# Altium schematic sheet [03]GateDriver.SchDoc
size A4; SheetNumber: 3; SheetTotal: 5
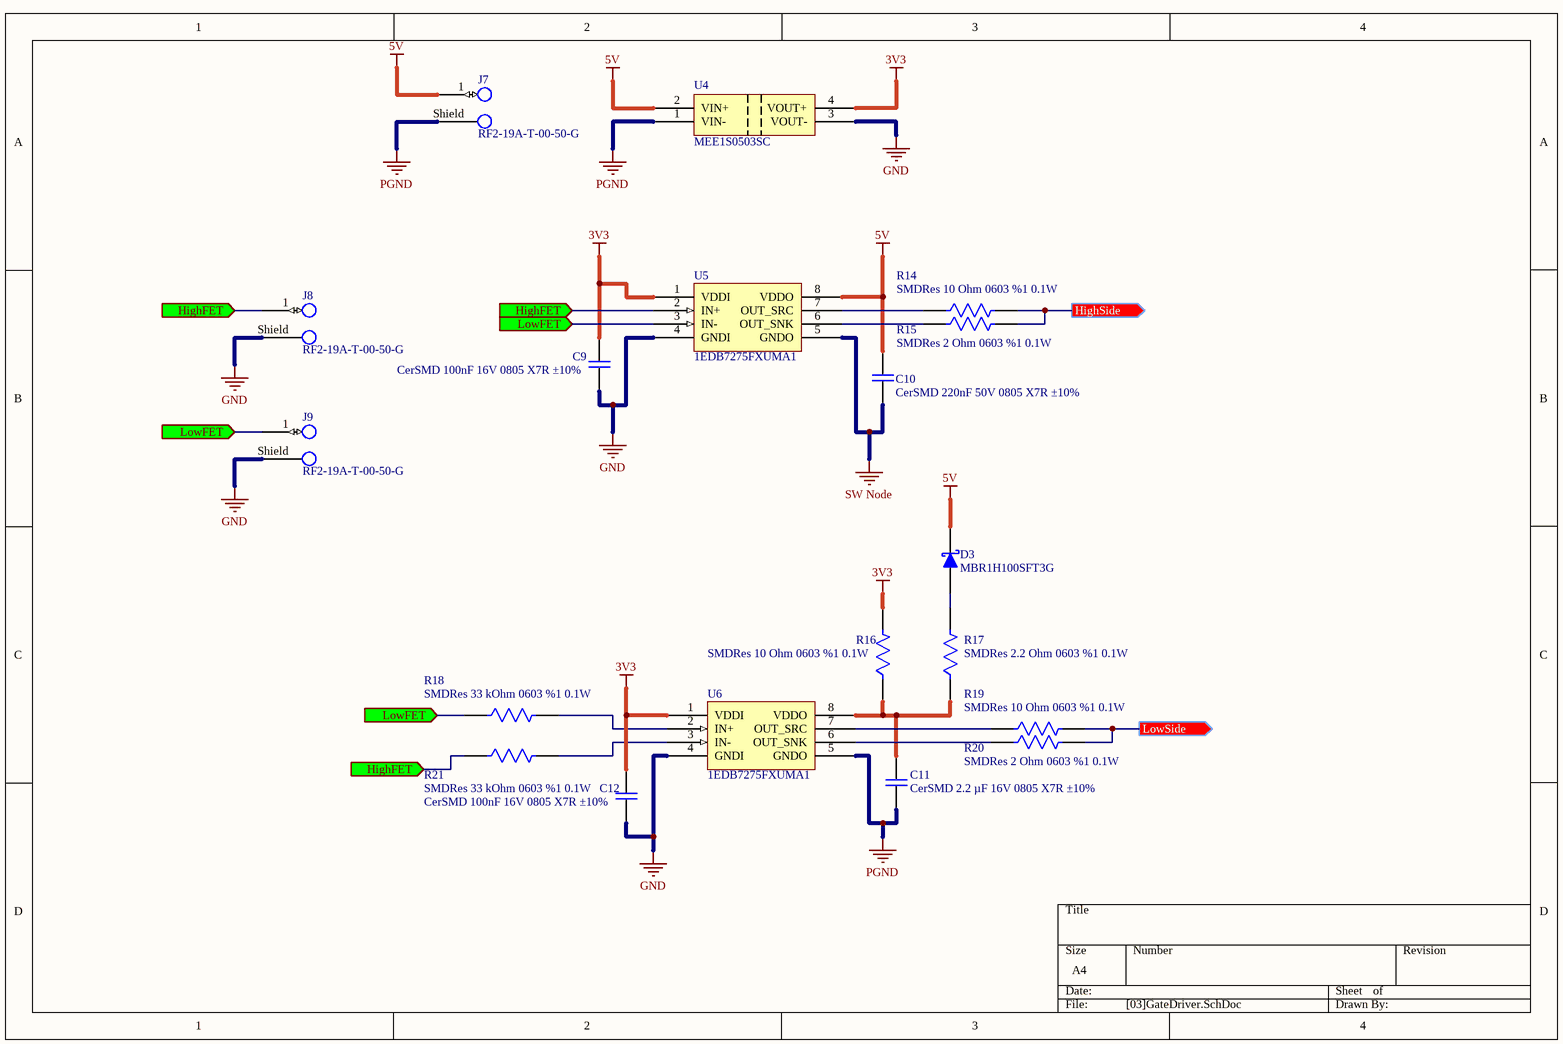
[diagram p0: [03]GateDriver.SchDoc]

## Parts
C9  CerSMD 100nF 16V 0805 X7R ±10%  [CAPC2012X09N]
C10  CerSMD 220nF 50V 0805 X7R ±10%  [CAPC2012X09N]
C11  CerSMD 2.2 µF 16V 0805 X7R ±10%  [CAPC2012X09N]
C12  CerSMD 100nF 16V 0805 X7R ±10%  [CAPC2012X09N]
D3  MBR1H100SFT3G  [SODFL360X95-2N]
J7  RF2-19A-T-00-50-G  [RF2-19A-T-00-50-G]
J8  RF2-19A-T-00-50-G  [RF2-19A-T-00-50-G]
J9  RF2-19A-T-00-50-G  [RF2-19A-T-00-50-G]
R14  SMDRes 10 Ohm 0603 %1 0.1W  [RESC1508X06N]
R15  SMDRes 2 Ohm 0603 %1 0.1W  [RESC1508X06N]
R16  SMDRes 10 Ohm 0603 %1 0.1W  [RESC1508X06N]
R17  SMDRes 2.2 Ohm 0603 %1 0.1W  [RESC1508X06N]
R18  SMDRes 33 kOhm 0603 %1 0.1W  [RESC1508X06N]
R19  SMDRes 10 Ohm 0603 %1 0.1W  [RESC1508X06N]
R20  SMDRes 2 Ohm 0603 %1 0.1W  [RESC1508X06N]
R21  SMDRes 33 kOhm 0603 %1 0.1W  [RESC1508X06N]
U4  MEE1S0503SC  [MEE1S0503SC-Footprint-1]
U5  1EDB7275FXUMA1  [SOIC127P600X175-8N]
U6  1EDB7275FXUMA1  [SOIC127P600X175-8N]

## Ports
HighFET (in, see [03]GateDriver[1B], [03]GateDriver[1C]), HighFET (in, see [03]GateDriver[1B], [03]GateDriver[2B]), HighFET (in, see [03]GateDriver[1C], [03]GateDriver[2B]), HighSide (out, see [05]BuckConverter[2B]), LowFET (in, see [03]GateDriver[1B], [03]GateDriver[1C]), LowFET (in, see [03]GateDriver[1B], [03]GateDriver[2B]), LowFET (in, see [03]GateDriver[1C], [03]GateDriver[2B]), LowSide (out, see [05]BuckConverter[2C])

## Nets
3V3: C9.1 C12.1 R16.2 U4.4(VOUT+) U5.1(VDDI) U6.1(VDDI)
5V: C10.1 D3.2(K) J7.1 U4.2(VIN+) U5.8(VDDO)
GND: C9.2 C12.2 J8.Shield J9.Shield U4.3(VOUT-) U5.4(GNDI) U6.4(GNDI)
PGND: C11.2 J7.Shield U4.1(VIN-) U6.5(GNDO)
SW Node: C10.2 U5.5(GNDO)
HighFET: J8.1 R21.1 U5.2(IN+) ; port HighFET
HighSide: R14.2 R15.2 ; port HighSide
LowFET: J9.1 R18.1 U5.3(IN-) ; port LowFET
LowSide: R19.2 R20.2 ; port LowSide
NetC11_1: C11.1 R16.1 R17.1 U6.8(VDDO)
NetD3_1: D3.1(A) R17.2
NetR14_1: R14.1 U5.7(OUT_SRC)
NetR15_1: R15.1 U5.6(OUT_SNK)
NetR18_2: R18.2 U6.2(IN+)
NetR19_1: R19.1 U6.7(OUT_SRC)
NetR20_1: R20.1 U6.6(OUT_SNK)
NetR21_2: R21.2 U6.3(IN-)

## Library data of the parts
C9 C12 = CMP-00013-1: Ceramic Capacitor SMD 100nF 10V 0805 X7R ±10%; Manufacturer Number: 885012207016; Manufacturer: Würth Elektronik; Temperature Coefficient: X7R; Mounting Type: Surface Mount; Package: 0603; Mouser Part Number: 710-885012207016; Voltage: 10V; Tolerance: ±10%; Temperature: -55°C up to 125°C; Digi-Key Part Number: 732-8026-1-ND; Farnell Part Number: 2534051
C10 = CMP-00016-1: Ceramic Capacitor SMD 220nF 50V 0805 X7R ±10%; Manufacturer: Murata Electronics; Manufacturer Number: GRM21BR71H224KA01L; Voltage: 10V; Tolerance: ±10%; Package: 0805; Mounting Type: Surface Mount; Mouser Part Number: 81-GRM40X7R224K050AL; Digi-Key Part Number: 490-1670-1-ND; Temperature: -55°C up to 125°C; Temperature Coefficient: X7R
C11 = CMP-00014-1: Ceramic Capacitor SMD 2.2 µF 16V 0805 X7R ±10%; Manufacturer Number: C2012X7R1C225K125AB; Manufacturer: TDK Corporation; Farnell Part Number: 1907345; Temperature Coefficient: X7R; Digi-Key Part Number: 445-1420-1-ND; Mounting Type: Surface Mount; Tolerance: ±10%; Package: 0805; Voltage: 16V; Mouser Part Number: 810-C2012X7R1C225K; Temperature: -55°C up to 125°C
D3 = CMP-00020-2
J7-J9 = CMP-00025-2: Rf Sma Connector
R14 R16 R19 = CMP-00017-1: Res Thick Film 0603 10 Ohm Ohm 1% 0.1W(1/10W) ±100ppm/C Pad SMD T/R Automotive AEC-Q200; Manufacturer Number: RMCF0603FT10R0; Manufacturer: Stackpole Electronics Inc; Package: 0603; Digi-Key Part Number: RMCF0603FT10R0CT-ND; Mouser Part Number: 708-RMCF0603FT10R0; Power: 0.1W; Mounting Type: Surface Mount; Temperature: -55°C up to 155°C; Tolerance: ±1%
R15 R20 = CMP-00019-1: Res Thick Film 0603 2 Ohm Ohm 1% 0.1W(1/10W) ±100ppm/C Pad SMD T/R Automotive AEC-Q200; Manufacturer: Stackpole Electronics Inc; Manufacturer Number: RMCF0603FT2R00; Mounting Type: Surface Mount; Power: 0.1W; Tolerance: ±1%; Package: 0603; Mouser Part Number: 708-RMCF0603FT2R00; Temperature: -55°C up to 155°C; Digi-Key Part Number: RMCF0603FT2R00CT-ND
R17 = CMP-00015-1: Res Thick Film 0603 2.2 Ohm Ohm 1% 0.1W(1/10W) ±100ppm/C Pad SMD T/R Automotive AEC-Q200; Manufacturer Number: RMCF0603FT2R20; Manufacturer: Stackpole Electronics Inc; Mouser Part Number: 708-RMCF0603FT2R20; Power: 0.1W; Tolerance: ±1%; Package: 0603; Temperature: -55°C up to 155°C; Digi-Key Part Number: RMCF0603FT2R20CT-ND; Mounting Type: Surface Mount
R18 R21 = CMP-00018-1: Res Thick Film 0603 33 kOhm Ohm 1% 0.1W(1/10W) ±100ppm/C Pad SMD T/R Automotive AEC-Q200; Manufacturer: Stackpole Electronics Inc; Manufacturer Number: RMCF0603FT33K0; Package: 0603; Tolerance: ±1%; Digi-Key Part Number: RMCF0603FT33K0CT-ND; Power: 0.1W; Temperature: -55°C up to 155°C; Mouser Part Number: 708-RMCF0603FT33K0; Mounting Type: Surface Mount
U4 = CMP-00029-1: Murata Power - 5V to 3.3V Isolated DC-DC Converter 1W
U5 U6 = CMP-00012-1